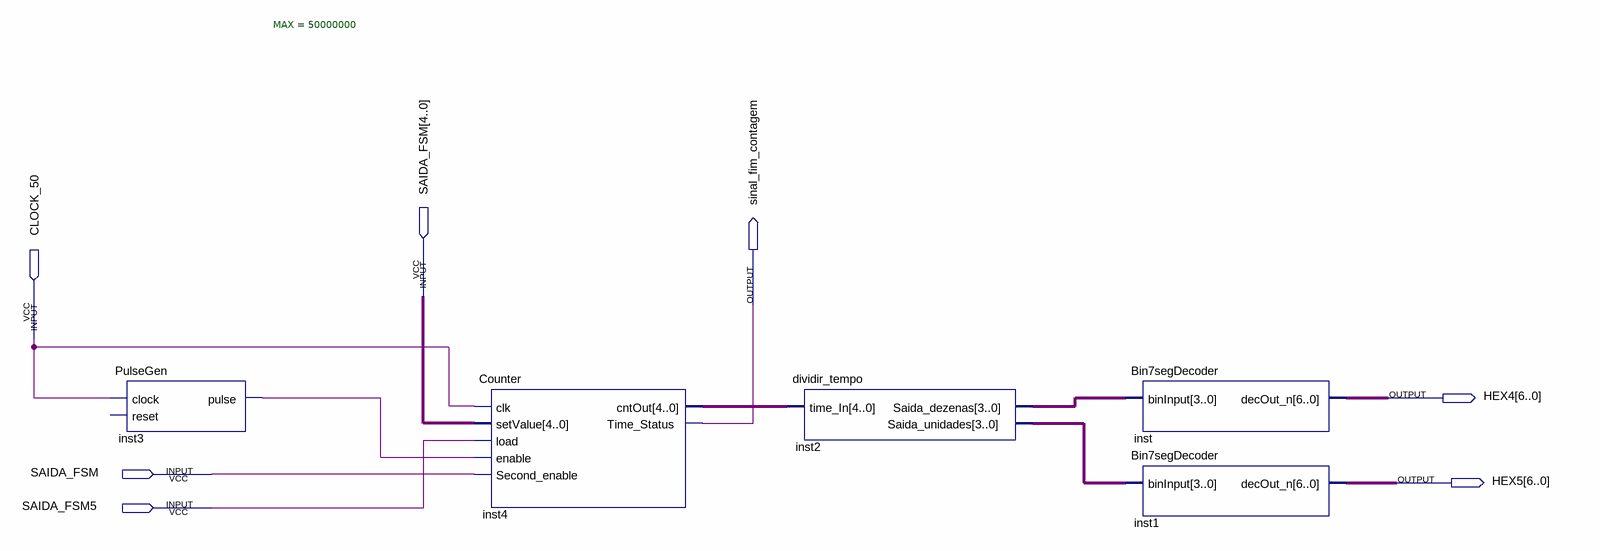
[diagram p0: schematic sheet]
// Quartus schematic apresentacao_2.bdf as structural Verilog: 5 symbols, 7 pins
module apresentacao_2 (
  input  [4:0] SAIDA_FSM,
  input  CLOCK_50,
  input  SAIDA_FSM_1bit,
  input  SAIDA_FSM5,
  output sinal_fim_contagem,
  output [6:0] HEX4,
  output [6:0] HEX5
);

  wire inst3_pulse;
  wire [3:0] inst2_saida_dezenas, inst2_saida_unidades;
  wire [4:0] inst4_cntout;

  PulseGen #(.MAX(50000000)) inst3 (.clock(CLOCK_50), .pulse(inst3_pulse));  // open: reset
  Counter inst4 (
    .clk(CLOCK_50), .setValue(SAIDA_FSM), .load(SAIDA_FSM5), .enable(inst3_pulse),
    .Second_enable(SAIDA_FSM_1bit), .cntOut(inst4_cntout), .Time_Status(sinal_fim_contagem));
  dividir_tempo inst2 (
    .time_In(inst4_cntout), .Saida_dezenas(inst2_saida_dezenas), .Saida_unidades(inst2_saida_unidades));
  Bin7segDecoder inst (.binInput(inst2_saida_dezenas), .decOut_n(HEX4));
  Bin7segDecoder inst1 (.binInput(inst2_saida_unidades), .decOut_n(HEX5));
endmodule
